# Altium schematic sheet GateWay-NRF-version-puissance.SchDoc
size A4
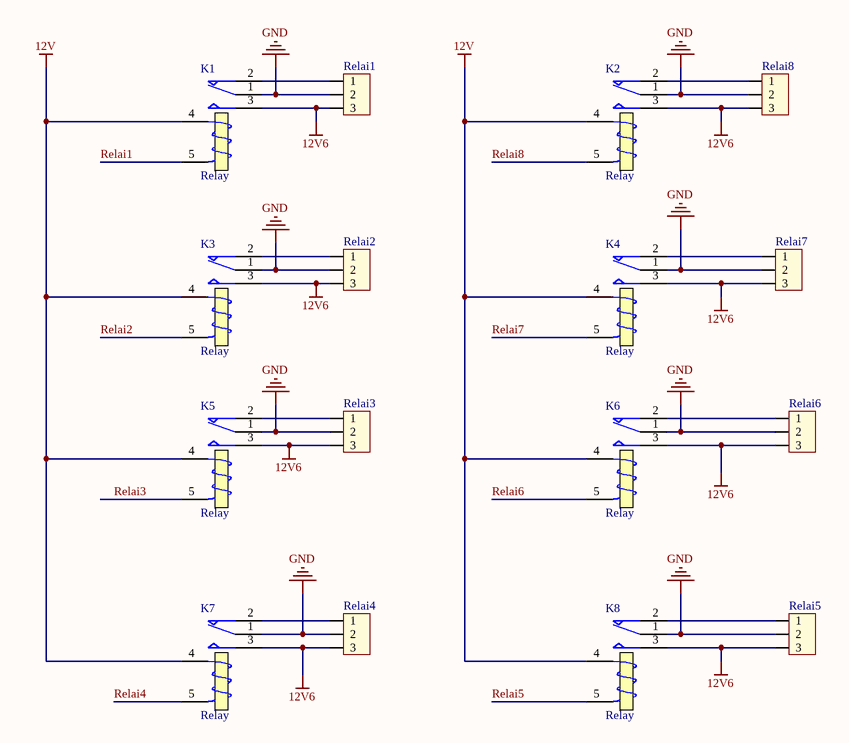
[diagram p0: GateWay-NRF-version-puissance.SchDoc]

## Parts
K1  Relay  [MODULE5B]
K2  Relay  [MODULE5B]
K3  Relay  [MODULE5B]
K4  Relay  [MODULE5B]
K5  Relay  [MODULE5B]
K6  Relay  [MODULE5B]
K7  Relay  [MODULE5B]
K8  Relay  [MODULE5B]
Relai1  Header 3  [HED3]  (value not drawn)
Relai2  Header 3  [HED3]  (value not drawn)
Relai3  Header 3  [HED3]  (value not drawn)
Relai4  Header 3  [HED3]  (value not drawn)
Relai5  Header 3  [HED3]  (value not drawn)
Relai6  Header 3  [HED3]  (value not drawn)
Relai7  Header 3  [HED3]  (value not drawn)
Relai8  Header 3  [HED3]  (value not drawn)

## Nets
12V: K1.4(T1) K2.4(T1) K3.4(T1) K4.4(T1) K5.4(T1) K6.4(T1) K7.4(T1) K8.4(T1)
12V6: K1.3(NO) K2.3(NO) K3.3(NO) K4.3(NO) K5.3(NO) K6.3(NO) K7.3(NO) K8.3(NO) Relai1.3 Relai2.3 Relai3.3 Relai4.3 Relai5.3 Relai6.3 Relai7.3 Relai8.3
GND: K1.1(COM) K2.1(COM) K3.1(COM) K4.1(COM) K5.1(COM) K6.1(COM) K7.1(COM) K8.1(COM) Relai1.2 Relai2.2 Relai3.2 Relai4.2 Relai5.2 Relai6.2 Relai7.2 Relai8.2
Relai1: K1.5(T2)
Relai2: K3.5(T2)
Relai3: K5.5(T2)
Relai4: K7.5(T2)
Relai5: K8.5(T2)
Relai6: K6.5(T2)
Relai7: K4.5(T2)
Relai8: K2.5(T2)
NetK1_2: K1.2(NC) Relai1.1
NetK2_2: K2.2(NC) Relai8.1
NetK3_2: K3.2(NC) Relai2.1
NetK4_2: K4.2(NC) Relai7.1
NetK5_2: K5.2(NC) Relai3.1
NetK6_2: K6.2(NC) Relai6.1
NetK7_2: K7.2(NC) Relai4.1
NetK8_2: K8.2(NC) Relai5.1

## Library data of the parts
K1-K8 = Relay: SPDT Relay; Published: 8-Jun-2000; LatestRevisionDate: 17-Jul-2002; LatestRevisionNote: Re-released for DXP Platform.; PackageReference: MODULE5B; Publisher: Altium Limited
Relai1-Relai8 = Hed3: Header 3 (Green); Value: Header 3